# Altium schematic sheet Block Diagram.SchDoc: Block Diagram
size Tabloid; ApprovedBy: NA; CompanyName: Cospan Design LLC; DrawnBy: Dave McCoy; Engineer: Dave McCoy; DocumentNumber: 1; Revision: A; SheetNumber: 1; SheetTotal: 20; Client: Public; Project: Enigma; ProjectPrettyName: Enigma
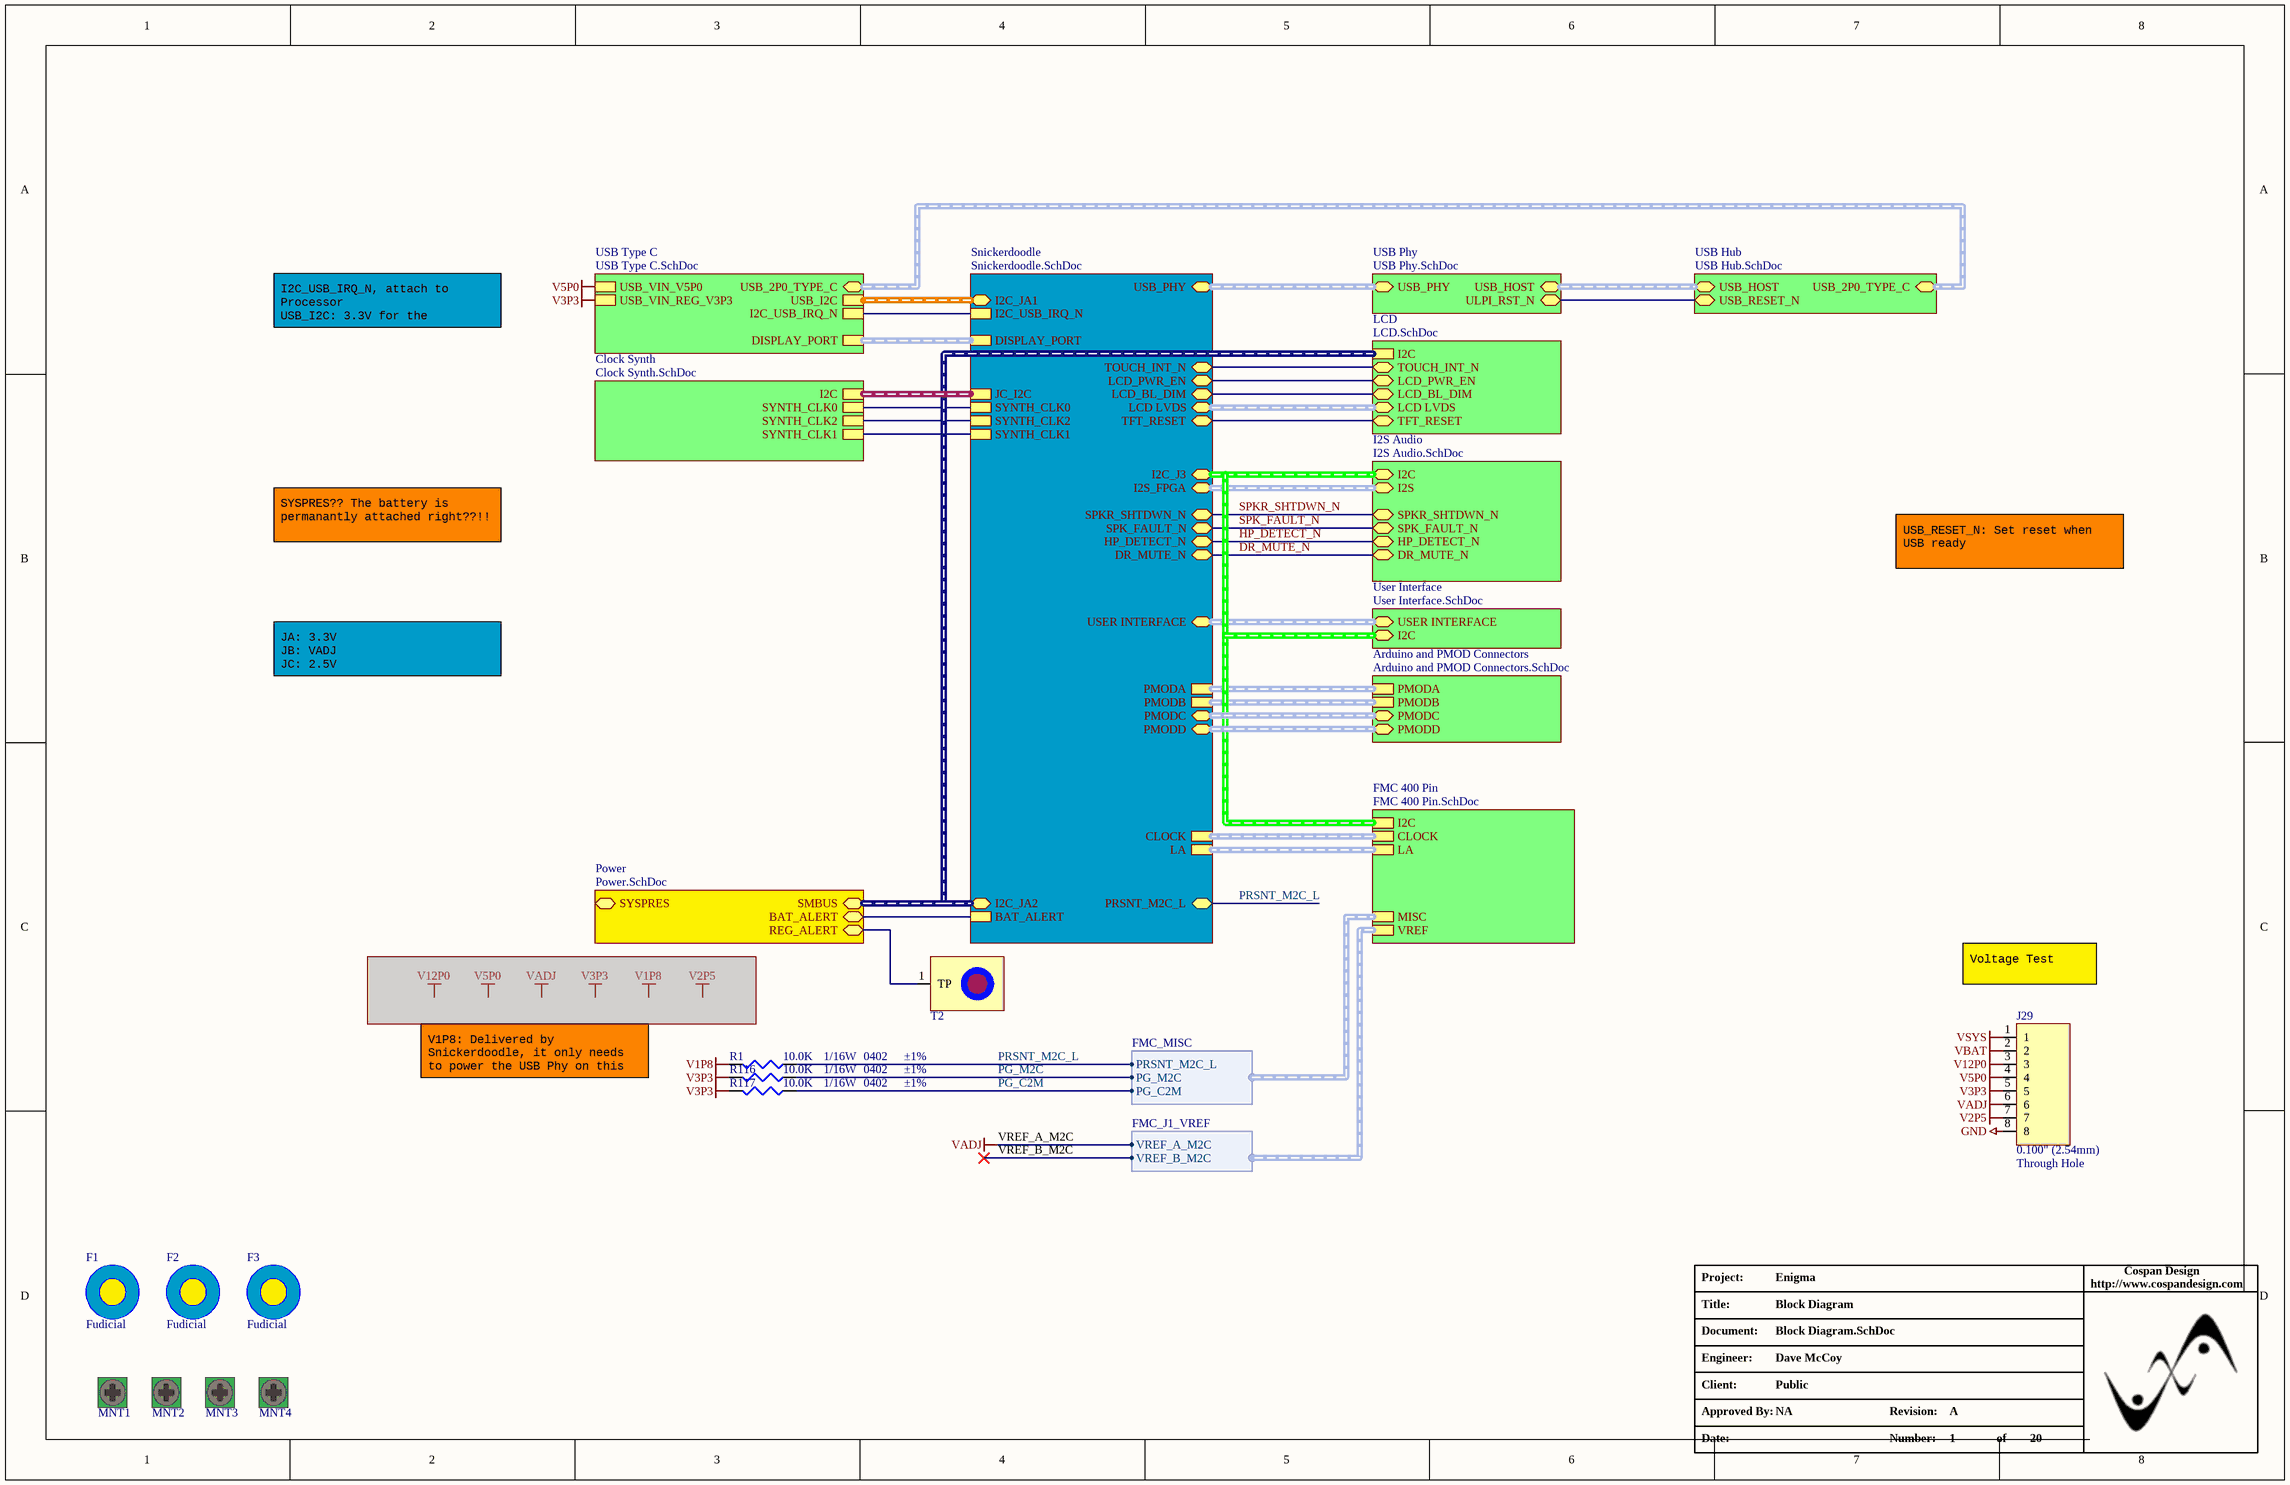
[diagram p0: Block Diagram.SchDoc]

## Parts
F1  Fudicial  [FIDUCIAL ROUND]  (no BOM)
F2  Fudicial  [FIDUCIAL ROUND]  (no BOM)
F3  Fudicial  [FIDUCIAL ROUND]  (no BOM)
J29  Pitch: 0.100" (2.54mm)  Mounting Type: Through Hole  [HDR_1X8 - FEMALE]  (hidden comment: J_HDR1X8_THRHOLE_VERT_RECPT)
MNT1  Mounting Hole  [MNT_4-40]  (value not drawn)  (no BOM)
MNT2  Mounting Hole  [MNT_4-40]  (value not drawn)  (no BOM)
MNT3  Mounting Hole  [MNT_4-40]  (value not drawn)  (no BOM)
MNT4  Mounting Hole  [MNT_4-40]  (value not drawn)  (no BOM)
R1  Resistance In Ohms: 10.0K  Power (Watts): 1/16W  Case: 0402  Tolerance: ±1%  [R_0402]  (hidden comment: R_0402_10.0K)
R116  Resistance In Ohms: 10.0K  Power (Watts): 1/16W  Case: 0402  Tolerance: ±1%  [R_0402]  (hidden comment: R_0402_10.0K)
R117  Resistance In Ohms: 10.0K  Power (Watts): 1/16W  Case: 0402  Tolerance: ±1%  [R_0402]  (hidden comment: R_0402_10.0K)
T2  TEST_POINT_SMALL  [TestPointSmall]  (value not drawn)  (no BOM)

## Sub-sheets
Arduino and PMOD Connectors = Arduino and PMOD Connectors.SchDoc: PMODA (harness PMOD_Harness), PMODB (harness PMOD_Harness), PMODC (harness PMOD_Harness), PMODD (harness PMOD_Harness)
Clock Synth = Clock Synth.SchDoc: I2C (harness I2C Harness), SYNTH_CLK0, SYNTH_CLK2, SYNTH_CLK1
FMC 400 Pin = FMC 400 Pin.SchDoc: LA (harness FMC_J1_LA), MISC (harness FMC_MISC), I2C (harness I2C Harness), CLOCK (harness FMC_J1_CLOCK), VREF (harness FMC_J1_VREF)
I2S Audio = I2S Audio.SchDoc: SPKR_SHTDWN_N, I2C (harness I2C Harness), I2S (harness I2S Harness), DR_MUTE_N, SPK_FAULT_N, HP_DETECT_N
LCD = LCD.SchDoc: LCD LVDS (harness LCD Harness), TFT_RESET, I2C (harness I2C Harness), LCD_PWR_EN, LCD_BL_DIM, TOUCH_INT_N
Power = Power.SchDoc: SMBUS (harness I2C Harness), SYSPRES, BAT_ALERT, REG_ALERT
Snickerdoodle = Snickerdoodle.SchDoc: I2S_FPGA (harness I2S Harness), SPKR_SHTDWN_N, DR_MUTE_N, SPK_FAULT_N, HP_DETECT_N, USB_PHY (harness USB Phy Harness), I2C_USB_IRQ_N, DISPLAY_PORT (harness Display Port), USER INTERFACE (harness User Interface Harness), PMODA (harness PMOD_Harness), PMODB (harness PMOD_Harness), BAT_ALERT, LA (harness FMC_J1_LA), CLOCK (harness FMC_J1_CLOCK), PMODC (harness PMOD_Harness), PMODD (harness PMOD_Harness), SYNTH_CLK0, SYNTH_CLK2, SYNTH_CLK1, JC_I2C (harness I2C Harness), I2C_JA1 (harness I2C Harness), LCD LVDS (harness LCD Harness), I2C_J3 (harness I2C Harness), I2C_JA2 (harness I2C Harness), TFT_RESET, LCD_PWR_EN, LCD_BL_DIM, TOUCH_INT_N, PRSNT_M2C_L
USB Hub = USB Hub.SchDoc: USB_HOST (harness USB Harness), USB_RESET_N, USB_2P0_TYPE_C (harness USB Harness)
USB Phy = USB Phy.SchDoc: USB_PHY (harness USB Phy Harness), USB_HOST (harness USB Harness), ULPI_RST_N
USB Type C = USB Type C.SchDoc: I2C_USB_IRQ_N, USB_VIN_REG_V3P3, DISPLAY_PORT (harness Display Port), USB_VIN_V5P0, USB_I2C (harness I2C Harness), USB_2P0_TYPE_C (harness USB Harness)
User Interface = User Interface.SchDoc: USER INTERFACE (harness User Interface Harness), I2C (harness I2C Harness)

## Harnesses
FMC_J1_VREF: VREF_A_M2C, VREF_B_M2C
FMC_MISC: PRSNT_M2C_L, PG_M2C, PG_C2M

## Nets
GND: J29.8
V1P8: R1.1
V2P5: J29.7
V3P3: J29.5 R116.1 R117.1 ; sheet USB Type C/USB_VIN_REG_V3P3
V5P0: J29.4 ; sheet USB Type C/USB_VIN_V5P0
V12P0: J29.3
VBAT: J29.2
VREF_A_M2C: J29.6 ; sheet FMC 400 Pin/VREF.VREF_A_M2C  [also labelled VADJ]
VSYS: J29.1
DR_MUTE_N: sheet Snickerdoodle/DR_MUTE_N, sheet I2S Audio/DR_MUTE_N
HP_DETECT_N: sheet Snickerdoodle/HP_DETECT_N, sheet I2S Audio/HP_DETECT_N
PG_C2M: R117.2 ; sheet FMC 400 Pin/MISC.PG_C2M
PG_M2C: R116.2 ; sheet FMC 400 Pin/MISC.PG_M2C
PRSNT_M2C_L: R1.2 ; sheet Snickerdoodle/PRSNT_M2C_L, sheet FMC 400 Pin/MISC.PRSNT_M2C_L
SPK_FAULT_N: sheet Snickerdoodle/SPK_FAULT_N, sheet I2S Audio/SPK_FAULT_N
SPKR_SHTDWN_N: sheet Snickerdoodle/SPKR_SHTDWN_N, sheet I2S Audio/SPKR_SHTDWN_N
VREF_B_M2C: sheet FMC 400 Pin/VREF.VREF_B_M2C
NetT2_1: T2.1(TP) ; sheet Power/REG_ALERT
(unnamed): sheet Snickerdoodle/I2C_USB_IRQ_N, sheet USB Type C/I2C_USB_IRQ_N
(unnamed): sheet Snickerdoodle/BAT_ALERT, sheet Power/BAT_ALERT
(unnamed): sheet Snickerdoodle/SYNTH_CLK0, sheet Clock Synth/SYNTH_CLK0
(unnamed): sheet Snickerdoodle/SYNTH_CLK2, sheet Clock Synth/SYNTH_CLK2
(unnamed): sheet Snickerdoodle/SYNTH_CLK1, sheet Clock Synth/SYNTH_CLK1
(unnamed): sheet Snickerdoodle/TFT_RESET, sheet LCD/TFT_RESET
(unnamed): sheet Snickerdoodle/LCD_PWR_EN, sheet LCD/LCD_PWR_EN
(unnamed): sheet Snickerdoodle/LCD_BL_DIM, sheet LCD/LCD_BL_DIM
(unnamed): sheet Snickerdoodle/TOUCH_INT_N, sheet LCD/TOUCH_INT_N
(unnamed): sheet USB Hub/USB_RESET_N, sheet USB Phy/ULPI_RST_N

## Buses and harness runs
harness sheet Arduino and PMOD Connectors/PMODA = sheet Snickerdoodle/PMODA
harness sheet Arduino and PMOD Connectors/PMODB = sheet Snickerdoodle/PMODB
harness sheet Arduino and PMOD Connectors/PMODC = sheet Snickerdoodle/PMODC
harness sheet Arduino and PMOD Connectors/PMODD = sheet Snickerdoodle/PMODD
harness sheet Clock Synth/I2C = sheet Snickerdoodle/JC_I2C
harness sheet FMC 400 Pin/CLOCK = sheet Snickerdoodle/CLOCK
harness sheet FMC 400 Pin/I2C = sheet I2S Audio/I2C = sheet Snickerdoodle/I2C_J3 = sheet User Interface/I2C
harness sheet FMC 400 Pin/LA = sheet Snickerdoodle/LA
harness sheet I2S Audio/I2S = sheet Snickerdoodle/I2S_FPGA
harness sheet LCD/I2C = sheet Power/SMBUS = sheet Snickerdoodle/I2C_JA2
harness sheet LCD/LCD LVDS = sheet Snickerdoodle/LCD LVDS
harness sheet Snickerdoodle/DISPLAY_PORT = sheet USB Type C/DISPLAY_PORT
harness sheet Snickerdoodle/I2C_JA1 = sheet USB Type C/USB_I2C
harness sheet Snickerdoodle/USB_PHY = sheet USB Phy/USB_PHY
harness sheet Snickerdoodle/USER INTERFACE = sheet User Interface/USER INTERFACE
harness sheet USB Hub/USB_2P0_TYPE_C = sheet USB Type C/USB_2P0_TYPE_C
harness sheet USB Hub/USB_HOST = sheet USB Phy/USB_HOST

## Notes on the sheet
- I2C_USB_IRQ_N, attach to Processor
  USB_I2C: 3.3V for the Processor
- SYSPRES?? The battery is permanantly attached right??!!
- USB_RESET_N: Set reset when USB ready
- JA: 3.3V
  JB: VADJ
  JC: 2.5V
- Voltage Test
- V1P8: Delivered by Snickerdoodle, it only needs to power the USB Phy on this board
- Project:
- http://www.cospandesign.com
- Cospan Design
- Document:
- Engineer:
- Title:
- Client:
- Approved By:
- Revision:
- Date:
- Number:
- of

## Library data of the parts
F1-F3 = F_FUDICIAL
J29 = J_HDR1X8_THRHOLE_VERT_FEMALE: CONN HEADER FEMALE 8POS .1" TIN; Manufacturer: Samtec; Manufacturer Part Number: SSW-108-01-T-S; Number of Positions: 8; Number of Positions Loaded: All; Supplier 1: Samtec; Supplier Part Number 1: SSW-108-01-T-S; RoHS: RoHS Compliant; Category: Connectors, Interconnects; Connector Type: Header; Contact Type: Female Socket; Number of Rows: 1; Termination: Solder; Fastening Type: -; Features: -; Contact Finish: Tin; Contact Finish Thickness: -; Color: Black; ComponentLink1URL: http://www.sullinscorp.com/drawings/101_xPxCxxxLFBN-RC,_10492-D.pdf; ComponentLink1Description: http://www.sullinscorp.com/drawings/101_xPxCxxxLFBN-RC,_10492-D.pdf; Pricing: 1=0.497
MNT1-MNT4 = MNT_440_HOLE
R1 R116 R117 = R_0402_10.0K: RES 10.0K OHM 1/16W 1% 0402 SMD; Manufacturer: Stackpole Electronics Inc; Manufacturer Part Number: RMCF0402FT10K0; Resistance (Ohms): 10k; Temperature Coefficient: ±100ppm/°C; Supplier 1: Digi-Key; Supplier Part Number 1: RMCF0402FT10K0CT-ND; RoHS: RoHS Compliant; Category: Resistors; Stock 1: 234525; Pricing: 1=0.04, 10=0.025, 50=0.0138, 100=0.0105, 250=0.0078, 500=0.00576, 1000=0.00384, 2500=0.00324, 5000=0.0027 (USD); Composition: Thick Film; Features: -; Package / Case: 0402 (1005 Metric); Size / Dimension: 0.039" L x 0.020" W (1.00mm x 0.50mm); Height: 0.016" (0.40mm); Number of Terminations: 2; Packaging: Cut Tape (CT); ComponentLink1URL: http://www.seielect.com/Catalog/SEI-RMCF_RMCP.pdf; ComponentLink1Description: http://www.seielect.com/Catalog/SEI-RMCF_RMCP.pdf
T2 = TEST_POINT_SMALL: OSCILLOSCOPE TEST POINT